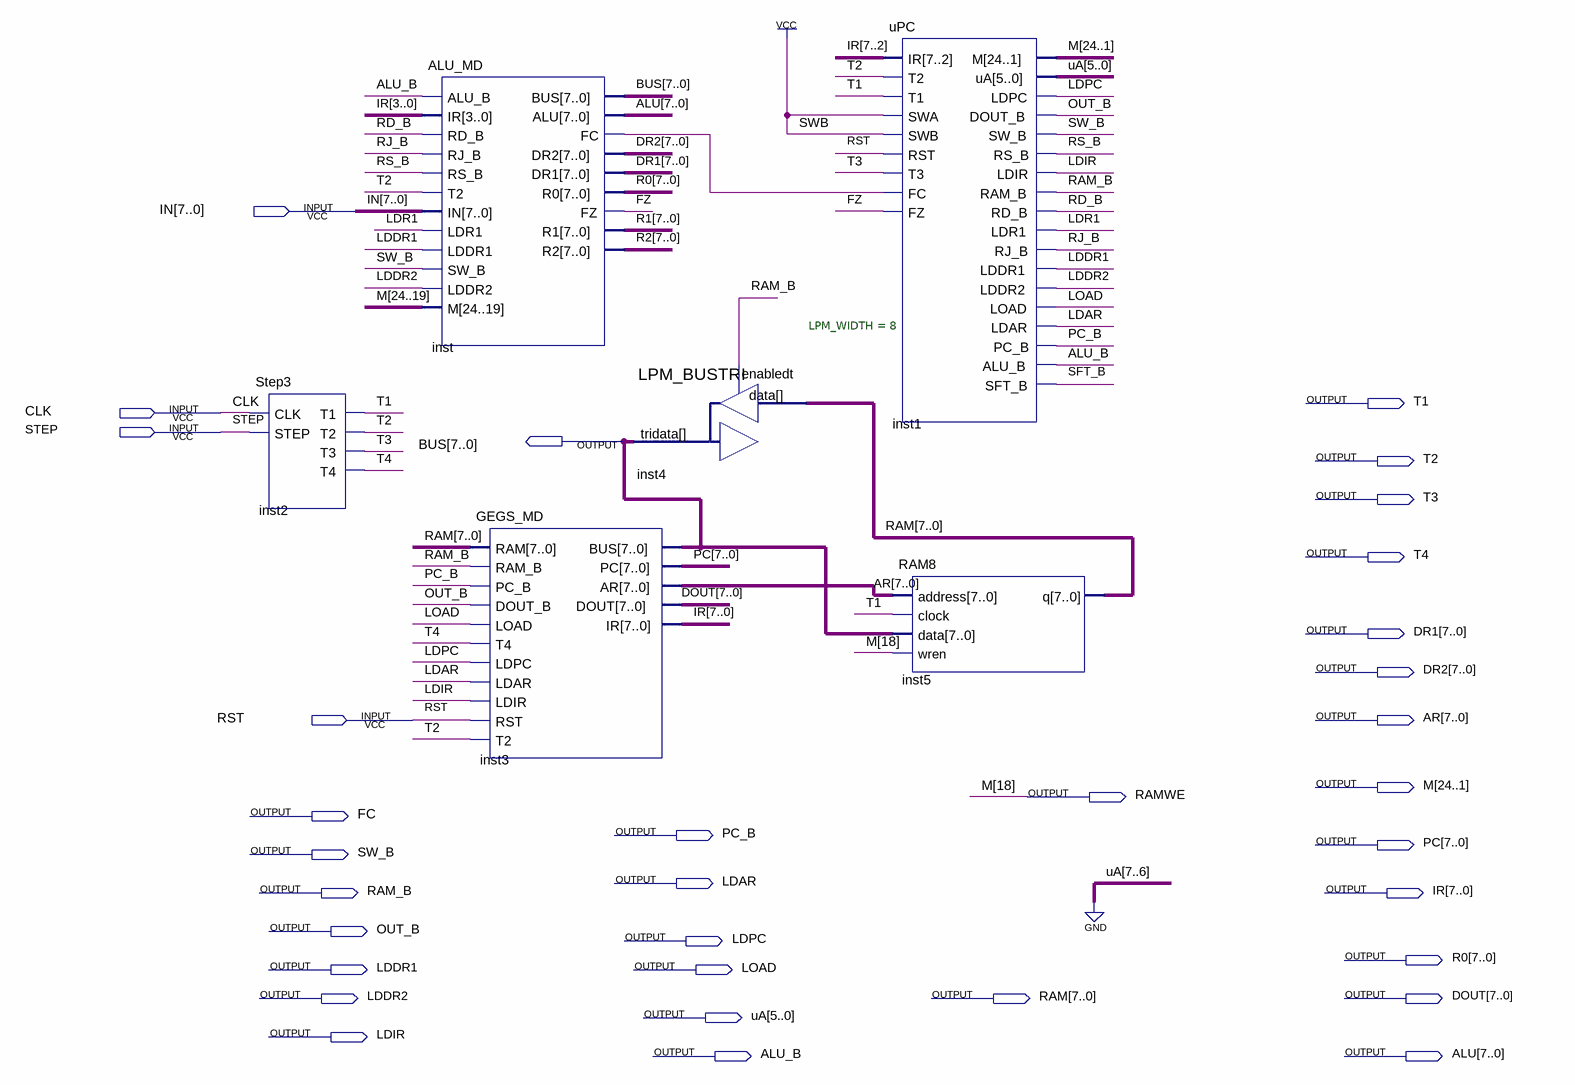
[diagram p0: schematic sheet]
// Quartus schematic CPUTop.bdf as structural Verilog: 6 symbols, 33 pins
module CPUTop (
  input  [7:0] IN,
  input  CLK,
  input  STEP,
  input  RST,
  output T1,
  output [7:0] BUS,
  output T2,
  output T3,
  output T4,
  output [7:0] DR1,
  output [7:0] DR2,
  output [7:0] AR,
  output [24:1] M,
  output RAMWE,
  output FC,
  output PC_B,
  output [7:0] PC,
  output SW_B,
  output LDAR,
  output RAM_B,
  output [7:0] IR,
  output OUT_B,
  output LDPC,
  output [7:0] R0,
  output LDDR1,
  output LOAD,
  output LDDR2,
  output [7:0] RAM,
  output [7:0] DOUT,
  output [5:0] uA,
  output LDIR,
  output ALU_B,
  output [7:0] ALU
);

  wire FZ, inst_fc, LDR1, RD_B, RJ_B, RS_B, SFT_B;
  wire [7:0] R1, R2;

  Step3 inst2 (.CLK(CLK), .STEP(STEP), .T1(T1), .T2(T2), .T3(T3), .T4(T4));
  ALU_MD inst (
    .ALU_B(ALU_B), .IR(IR[3:0]), .RD_B(RD_B), .RJ_B(RJ_B), .RS_B(RS_B), .T2(T2), .IN(IN), .LDR1(LDR1),
    .LDDR1(LDDR1), .SW_B(SW_B), .LDDR2(LDDR2), .M(M[24:19]), .BUS(BUS), .ALU(ALU), .FC(inst_fc), .DR2(DR2),
    .DR1(DR1), .R0(R0), .FZ(FZ), .R1(R1), .R2(R2));
  GEGS_MD inst3 (
    .RAM(RAM), .RAM_B(RAM_B), .PC_B(PC_B), .DOUT_B(OUT_B), .LOAD(LOAD), .T4(T4), .LDPC(LDPC), .LDAR(LDAR),
    .LDIR(LDIR), .RST(RST), .T2(T2), .BUS(BUS), .PC(PC), .AR(AR), .DOUT(DOUT), .IR(IR));
  LPM_BUSTRI #(.LPM_WIDTH(8)) inst4 (.data(RAM), .enabledt(RAM_B), .tridata(BUS));
  uPC inst1 (
    .IR(IR[7:2]), .T2(T2), .T1(T1), .SWA(1'b1), .SWB(1'b1), .RST(RST), .T3(T3), .FC(inst_fc), .FZ(FZ), .M(M),
    .uA(uA), .LDPC(LDPC), .DOUT_B(OUT_B), .SW_B(SW_B), .RS_B(RS_B), .LDIR(LDIR), .RAM_B(RAM_B), .RD_B(RD_B),
    .LDR1(LDR1), .RJ_B(RJ_B), .LDDR1(LDDR1), .LDDR2(LDDR2), .LOAD(LOAD), .LDAR(LDAR), .PC_B(PC_B),
    .ALU_B(ALU_B), .SFT_B(SFT_B));
  RAM8 inst5 (.address(AR), .clock(T1), .data(BUS), .wren(M[18]), .q(RAM));

  assign RAMWE = M[18];
endmodule
